# Altium schematic sheet keys_set.SchDoc
size A; SheetNumber: 3; SheetTotal: 3
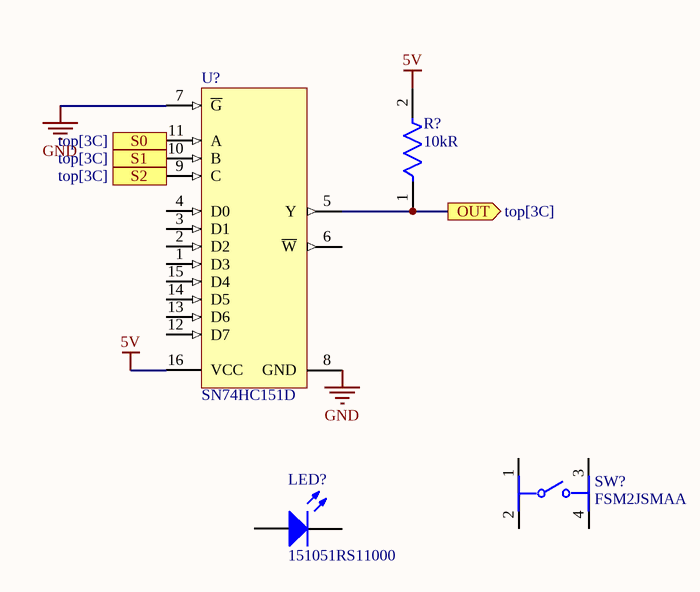
[diagram p0: keys_set.SchDoc]

## Parts
LED?  151051RS11000  [Type 5mm]
R?  Resistance: 10kR  [FP-RC0603-0_55-IPC_C]  (hidden comment: RC0603FR-0710KL)
SW?  FSM2JSMAA  [FP-FSM2JSMAA-MFG]
U?  SN74HC151D  [D0016A_L]

## Ports
OUT (out, see top[3C]), S0 (in, see top[3C]), S1 (in, see top[3C]), S2 (in, see top[3C])

## Nets
5V: R?.2 U?.16(VCC)
GND: U?.7(~{G}) U?.8(GND)
OUT: R?.1 U?.5(Y) ; port OUT
S0: U?.11(A) ; port S0
S1: U?.10(B) ; port S1
S2: U?.9(C) ; port S2

Not connected (* = marked no-connect by the designer): LED? 1(K) 2(A); SW? 1 2 3 4; U? 1(D3) 2(D2) 3(D1) 4(D0) 6(~{W}) 12(D7) 13(D6) 14(D5) 15(D4)

## Library data of the parts
LED? = CMP-1488-00008-1: THT LED round mono-color color lens, WL-TMRW, Red; Manufacturer: Wuerth Elektronik; PackageReference: Type 5mm; PartNumber: 151051RS11000; ComponentLink2URL: http://katalog.we-online.de/pbs/datasheet/7448042001.pdfhttp://katalog.we-online.de/pbs/datasheet/7448042001.pdfhttp://katalog.we-online.de/pbs/datasheet/7448042001.pdfhttp://katalog.we-online.de/pbs/datasheet/151051RS11000.pdf; ComponentLink1URL: http://www.we-online.com; ComponentLink1Description: Manufacturer URL; ComponentLink2Description: Datasheet; Emitting color: Red
R? = CMP-2100-03664-2: RES 10K OHM 1% 1/10W 0603; Voltage Rating: 75V; Voltage Rating (DC): 50V; Power Rating: 100mW; Temperature Coefficient: 100ppm/°C; Depth: 0.8mm; Termination: SMD/SMT; Resistor Type: Thick Film; Series: RC; Construction: Rectangular; Features: Moisture Resistant; Packaging: Tape and Reel; Min Operating Temperature: -55°C; Number of Terminations: 2; Lead Pitch: 0.3mm; RoHS Compliant: Yes; Case/Package: 0603; Resistance Tolerance: 1%; Military Standard: Not; Weight: 7.1E-05oz; Number of Pins: 2; Tolerance: 1%; Length: 1.6mm; Case Code (Imperial): 0603; Lead Free: Lead Free; Width: 0.8mm; Max Power Dissipation: 100mW; Height: 0.45mm; Max Operating Temperature: 155°C; Case Code (Metric): 1608; Size Code: 0603
SW? = CMP-03402-000003-1: SWITCH TACTILE SPST-NO 0.05A 24V; Manufacturer: TE Connectivity; Standoff Height: 0.05mm; Contact Current Rating: 50mA; Electromechanical Life: 100000Cycles; Operating Force: 260gf; Contact Resistance: 100mΩ; Package: 0; Temperature Range High: +85°C; Temperature: -35°C to +85°C; Category: Switch; Manufacturer Part Number: FSM2JSMAA; RoHS: TRUE; Mouser Description: Tactile Switches TACTILE 260G FORCE S; Device Class L1: Electromechanical; Mount: Surface Mount; Height: 4.59mm; ComponentLink2URL: https://www.te.com/commerce/DocumentDelivery/DDEController?Action=showdoc&DocId=Customer+Drawing%7F2-1437565-7%7FV%7Fpdf%7FEnglish%7FENG_CD_2-1437565-7_V.pdf%7F2-1437565-8; Temperature Range Low: -35°C; Voltage Rating Dc: 24V; Lead Free: Yes; Automotive: No; Throw Configuration: SPST-NO; Octopart: https://octopart.com/fsm2jsmaa-te+connectivity-41720620; Device Class L2: Switches; Device Class L3: Pushbutton Switches; ComponentLink2Description: Datasheet; Digikey Description: SWITCH TACTILE SPST-NO 0.05A 24V
U? = CMP-1633-00051-2: 8-Line To 1-Line Data Selectors/Multiplexers, D0016A, TUBE; Manufacturer: Texas Instruments; tpd @ Nom Voltage(Max)(ns): 63; Input Type: LVTTL/CMOS; Output Drive (IOL/IOH)(Max)(mA): 7.8/-7.8; ICC @ Nom Voltage(Max)(mA): 0.08; Function: Encoder/Multiplexer; Bits(#): 8; VCC(Min)(V): 2; Schmitt Trigger: No; Channels(#): 1; Voltage(Nom)(V): 3.3,5; Configuration: 8：1; Output Type: CMOS; Technology Family: HC; F @ Nom Voltage(Max)(Mhz): 28; VCC(Max)(V): 6; Rating: Catalog; Generic Part Number: SN74HC151; Code_JEDEC: MS-012 variation AC; Operating Temperature Range(C): -40 to 85; Type: Standard; DatasheetVersion: SCLS110E; PackageReference: D0016A